# Altium schematic sheet Downloader.SchDoc
size A; SheetNumber: 3; SheetTotal: 5
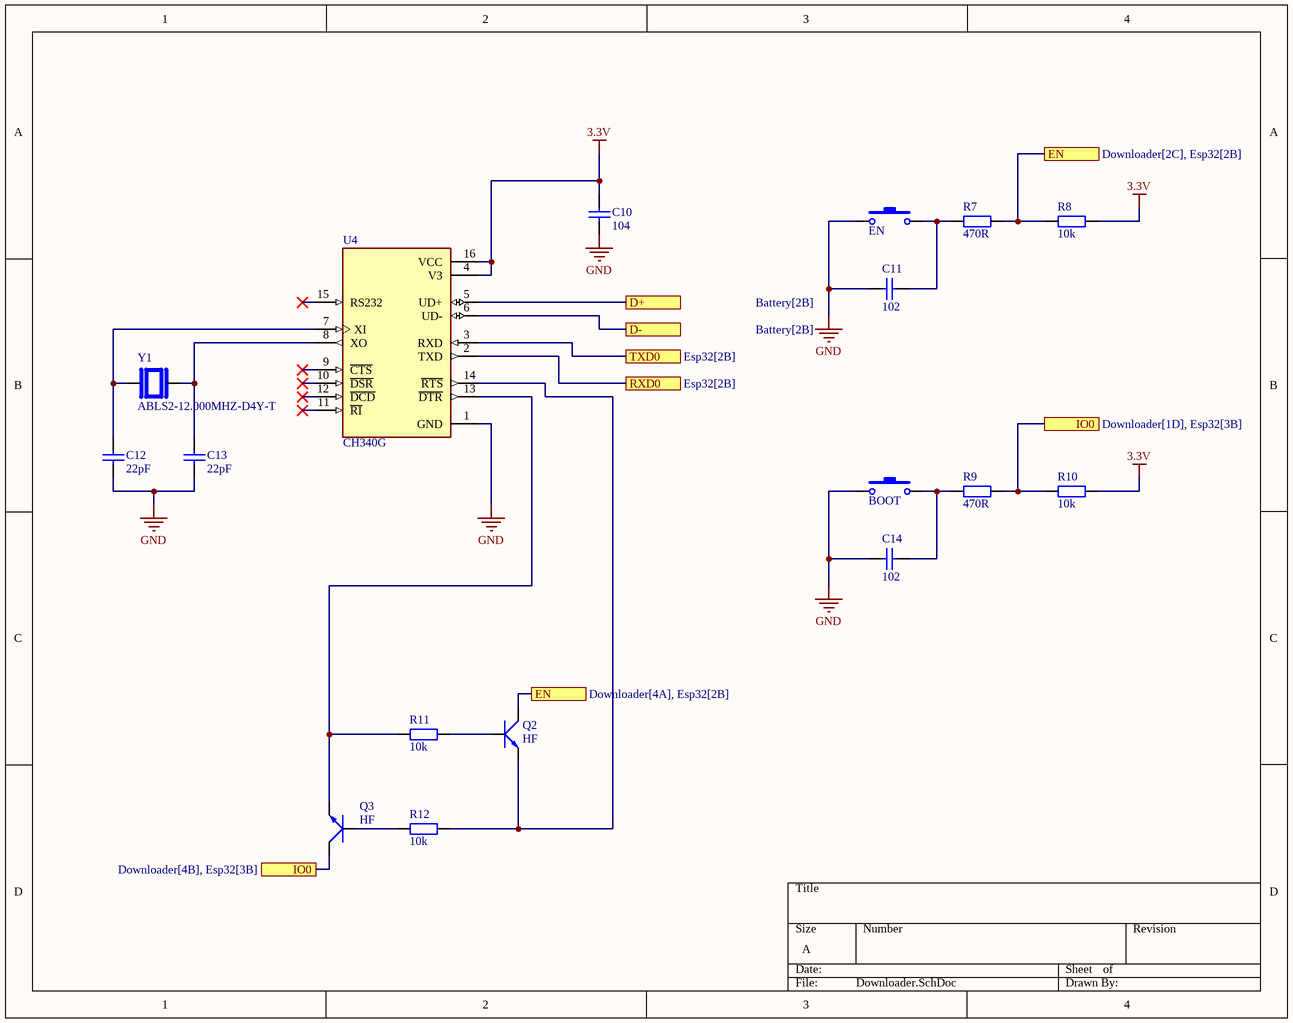
[diagram p0: Downloader.SchDoc]

## Parts
BOOT  Nut Nhan 2 Chan SMD 3x6x2.5  [Nut Nhan 2 Chan SMD 3x6x2.5]  (value not drawn)
C10  104  [tu 0805]
C11  102  [tu 0805]
C12  22pF  [tu 0805]
C13  22pF  [tu 0805]
C14  102  [tu 0805]
EN  Nut Nhan 2 Chan SMD 3x6x2.5  [Nut Nhan 2 Chan SMD 3x6x2.5]  (value not drawn)
Q2  HF  [SOT-23]
Q3  HF  [SOT-23]
R7  470R  [Tro SMD 0805]
R8  10k  [tro smd 0805]
R9  470R  [Tro SMD 0805]
R10  10k  [tro smd 0805]
R11  10k  [tro smd 0805]
R12  10k  [tro smd 0805]
U4  CH340G  [SOIC127P600X180-16N]
Y1  ABLS2-12.000MHZ-D4Y-T  [XTAL_ABLS2-12.000MHZ-D4Y-T]

## Ports
D+ (see Battery[2B]), D- (see Battery[2B]), EN (see Downloader[2C], Esp32[2B]), EN (see Downloader[4A], Esp32[2B]), IO0 (see Downloader[1D], Esp32[3B]), IO0 (see Downloader[4B], Esp32[3B]), RXD0 (see Esp32[2B]), TXD0 (see Esp32[2B])

## Nets
3.3V: C10.1 R8.2 R10.2 U4.4(V3) U4.16(VCC)
GND: BOOT.1 C10.2 C11.2 C12.2 C13.2 C14.2 EN.1 U4.1(GND)
D+: U4.5(UD+) ; port D+
D-: U4.6(UD-) ; port D-
EN: Q2.3(C) R7.2 R8.1 ; port EN
IO0: Q3.3(C) R9.2 R10.1 ; port IO0
RXD0: U4.2(TXD) ; port RXD0
TXD0: U4.3(RXD) ; port TXD0
NetBOOT_2: BOOT.2 C14.1 R9.1
NetC11_1: C11.1 EN.2 R7.1
NetC12_1: C12.1 U4.7(XI) Y1.1
NetC13_1: C13.1 U4.8(XO) Y1.2
NetQ2_1: Q2.1(B) R11.2
NetQ2_2: Q2.2(E) R12.2 U4.14(~{RTS})
NetQ3_1: Q3.1(B) R12.1
NetQ3_2: Q3.2(E) R11.1 U4.13(~{DTR})

Not connected (* = marked no-connect by the designer): U4 9(~{CTS})* 10(~{DSR})* 11(~{RI})* 12(~{DCD})* 15(RS232)*

## Library data of the parts
BOOT EN = Nut Nhan 2 Chan SMD 3x6x2.5: Ma_Hang: MH001036; Ten: Nút Nhấn 2 Chân 3x6x2.5MM SMD
C10 = Tu 0805 104 50V 10%: Dán; Don_Vi: Con; So_Chan: 2; Ten_Linh_Kien: Tụ 0805 104-100nF 10% 50V; Ma_Hang: MH004551; Chung_Loai: Dán; Kieu_Chan: *
C11 C14 = Tu 0805 102 50V 10%: Dán; Don_Vi: Con; So_Chan: 2; Ten_Linh_Kien: Tụ 0805 102-1nF 10% 50V; Ma_Hang: MH004549; Chung_Loai: Dán; Kieu_Chan: *
C12 C13 = Tu 0805 22pF 50V 10%: Dán; Don_Vi: Con; So_Chan: 2; Ten_Linh_Kien: Tụ 0805 22P 10% 50V; Ma_Hang: MH004560; Chung_Loai: Dán; Kieu_Chan: *
Q2 Q3 = Trans C1815 HF SMD: SOT-23; Value: C9014
R7 R9 = Tro 0805 5% 470R: Dán; Don_Vi: Con; Ma_Hang: MH005341; Ten_Linh_Kien: Trở 0805 5% 470R; So_Chan: 2; Chung_Loai: Dán; Kieu_Chan: *
R8 R10-R12 = Tro 0805 5% 10k: Dán; Don_Vi: Con; So_Chan: 2; Ten_Linh_Kien: Trở 0805 5% 10k; Ma_Hang: MH005239; Chung_Loai: Dán; Kieu_Chan: *
U4 = CH340G: USB Interface Integrated Circuit; MF: WCH; Value: *; SnapEDA_Link: https://www.snapeda.com/parts/Ch340G/WCH/view-part/?ref=snap; MP: Ch340G; Check_prices: https://www.snapeda.com/parts/Ch340G/WCH/view-part/?ref=eda; Availability: Not in stock; Price: None; Package: None
Y1 = ABLS2-12.000MHZ-D4Y-T: HC/49US (AT49) LOW PROFILE SURFACE MOUNT MICROPROCESSOR CRYSTAL; MF: Abracon; Purchase-URL: https://pricing.snapeda.com/search/part/ABLS2-12.000MHZ-D4Y-T/?ref=eda; Package: HC49/US Abracon; MP: ABLS2-12.000MHZ-D4Y-T; Value: *; Price: None; Availability: In Stock; SnapEDA_Link: https://www.snapeda.com/parts/ABLS2-12.000MHZ-D4Y-T/Abracon+LLC/view-part/?ref=snap; Check_prices: https://www.snapeda.com/parts/ABLS2-12.000MHZ-D4Y-T/Abracon+LLC/view-part/?ref=eda